# EAGLE design BigGridPixel (EAGLE 5.10)
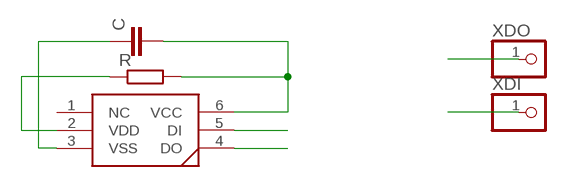
[diagram p0: schematic, sheet 1]

## Parts
C  C-EUC0805  [C0805]
R  R-EU_R0805  [R0805]
U$1  WS2812  [5050LED]
XDI  PINHD-1X1  [1X01]
XDO  PINHD-1X1  [1X01]

## Nets
DI: U$1.5(DI)
DO: U$1.4(DO)
N$1: C.2 R.2 U$1.6(VCC)
VDD: R.1 U$1.2(VDD)
VSS: C.1 U$1.3(VSS)
XDI: XDI.1
XDO: XDO.1
Unconnected: U$1.1(NC)

## Library data of the parts
C = rcl:C-EU: CAPACITOR, European symbol
R = rcl:R-EU_: RESISTOR, European symbol
U$1 = jasons_stuff:WS2812
XDI XDO = adafruit:PINHD-1X1: Pin header 1x1 for 0.1" spacing With round pins

## Board
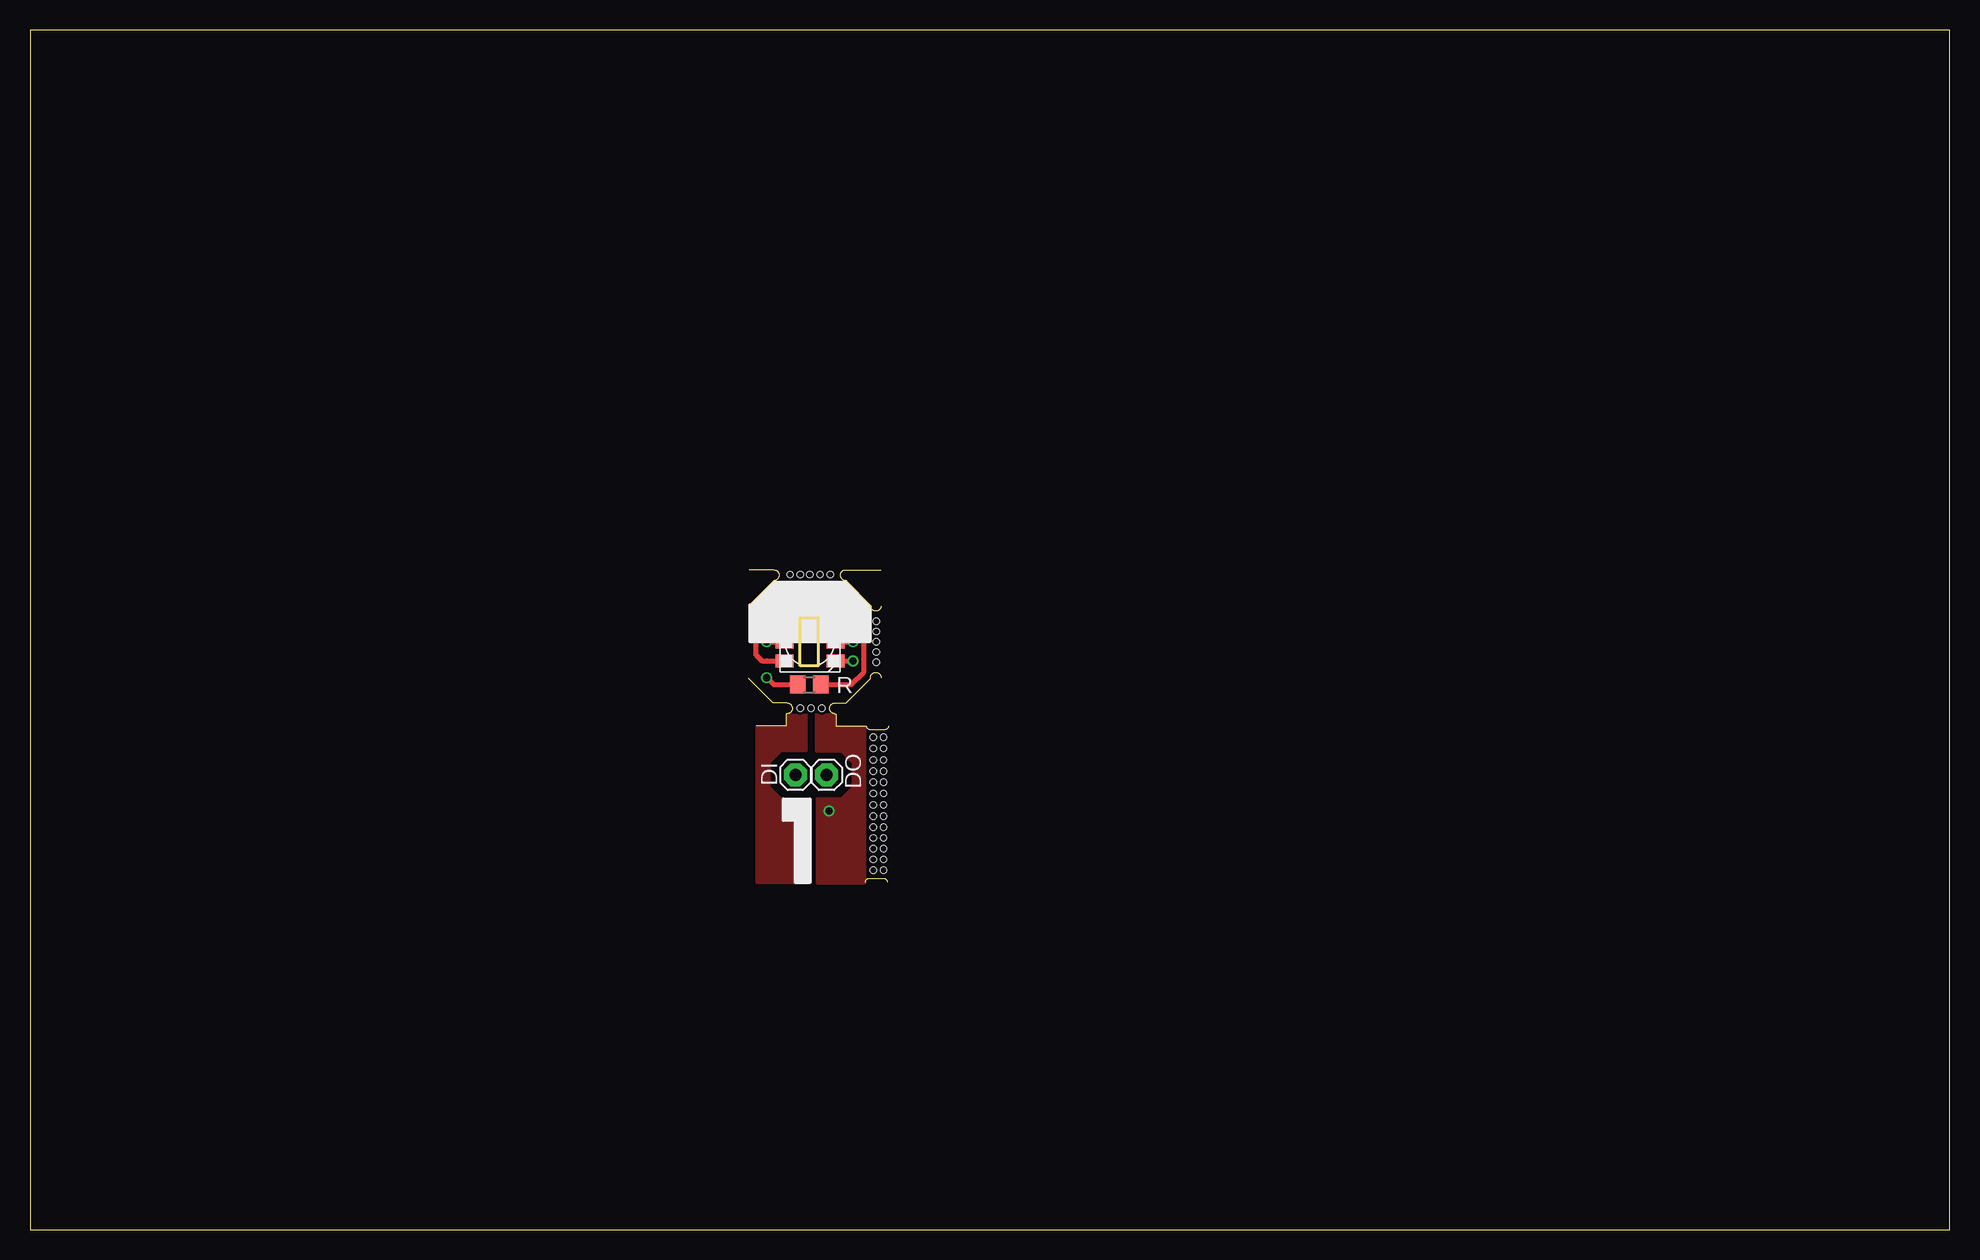
[diagram p1: board, top side]
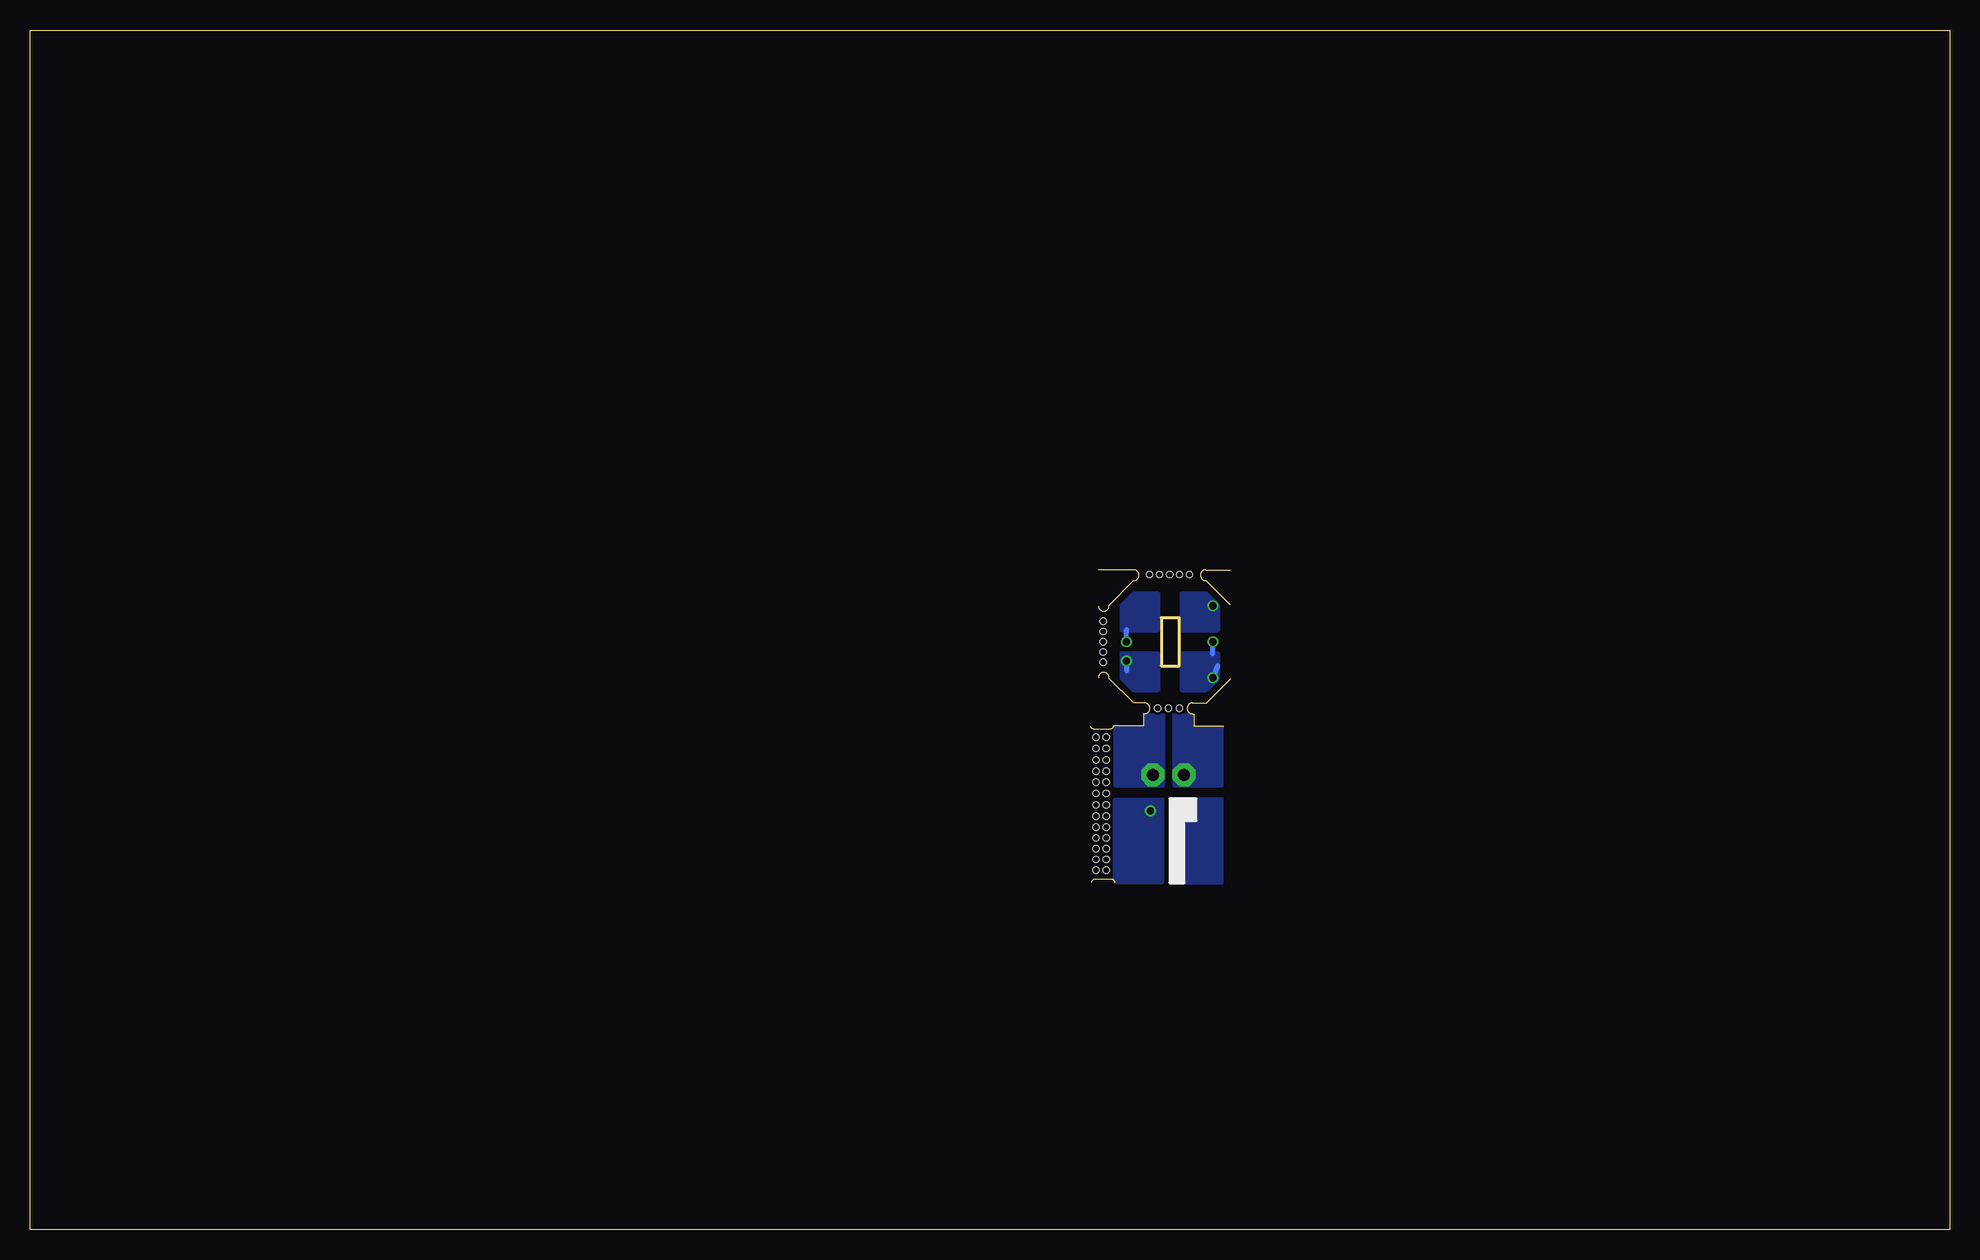
[diagram p2: board, bottom side, seen from below]

Size 160 x 100 mm. Coordinates in mm from the lower left corner, seen from the top.
Outline: 0,0 160,0 160,100 0,100 0,0
Copper layers (1*16): Top 0.035mm / dielectric 1.5mm / Bottom 0.035mm
Design rules "dirt_cheap_dirty_boards.v1": minimum track width 5mil, minimum drill 12mil, track to track 5mil, track to pad 5mil, pad to pad 5mil, via to via 5mil, smd to smd 0mil, copper to edge 10mil, drill to drill 10mil, minimum pad ring 10mil, minimum via ring 6mil, stop-mask expansion 2mil, vias tented up to drill 25mil, thermal gap 10mil
Holes 0.5 mm at 64.2,43.45 66,43.45 65.1,43.45 63.35,54.6 65.85,54.6 64.2,54.6 65,54.6 66.7,54.6 70.55,49 70.55,50.7 70.55,49.85 70.55,48.15 70.55,47.3 70.3,41.05 70.3,40.1 70.3,39.15 70.3,38.2 70.3,37.3 70.3,36.35 70.3,35.4 70.3,34.45 70.3,33.55 70.3,32.65 70.3,31.75 70.3,30.85 70.3,29.95 71.15,41.05 71.15,40.1 71.15,39.15 71.15,38.2 71.15,37.3 71.15,36.35 71.15,35.4 71.15,34.45 71.15,33.55 71.15,32.65 71.15,31.75 71.15,30.85 71.15,29.95
Milling: 33 lines

### Footprints (pad centres in the part's own frame; a part is rotated, then mirrored left to right if it is on the bottom)
C0805 = smd 1.3 x 1.5: 1 -0.95,0; 2 0.95,0
R0805 = smd 1.3 x 1.5: 1 -0.95,0; 2 0.95,0
5050LED = smd 1.5 x 1.1: 1 -2.16,1.59; 2 -2.11,-0.01; 3 -2.11,-1.61; 4 2.14,-1.61; 5 2.14,-0.01; 6 2.14,1.59
1X01 = drill 1.016 pad 1.93 octagon: 1 0,0

### Placement (x,y rotation side)
C  64.96,52.6 0 top
R  64.96,45.42 0 top
U$1  65,49 0 top
XDI  63.8,37.9 0 top
XDO  66.4,37.9 0 top

### Tracks (layer width: path | path; a pad name or v marks a point on that pad's centre or on a via)
DI  (via drill 0.6 pad 0.25)
  Top 0.406: v68.6,49 U$1.5
  Bottom 0.406: v68.6,49 68.6,50
  pour Bottom: 66,50 66,53 68,53 69,52 69,50
DO  (via drill 0.6 pad 0.25)
  Top 0.406: U$1.4 v68.59,47.39 v68.6,47.4
  Bottom 0.406: v68.6,47.4 68.6,46.6
  pour Bottom: 66,48 69,48 69,46 68,45 66,45
N$1
  Top 0.406: C.2 66.9,52.6 67.14,52.36 U$1.6 69.21,50.59 69.5,50.6 69.5,46.5 68.42,45.42 R.2
VDD  (via drill 0.6 pad 0.25)
  Top 0.406: 63.59,45 R.1 61.98,45.42 v61.4,46 | U$1.2 v61.4,49
  Bottom 0.406: 61.4,48 v61.4,49 | v61.4,46 61,47
  pour Bottom: 64,45 62,45 61,46 61,48 64,48
VSS  (via drill 0.6 pad 0.25)
  Top 0.406: U$1.3 61.51,47.39 61.4,47.4 61,47.4 60.5,47.9 60.5,51.1 v61.4,52 62,52.6 C.1
  pour Bottom: 64,50 61,50 61,52 62,53 64,53
XDI
  pour Bottom (no thermals): 60.6,41.9 63.1,41.9 63.1,42.9 64.7,42.9 64.7,37 60.6,37
XDO
  pour Bottom (no thermals): 65.5,37 65.5,42.9 67.1,42.9 67.1,41.9 69.6,41.9 69.6,37
XVDD  (via drill 0.6 pad 0.25)
  other vias: 66.6,34.9
  pour Bottom: 65.6,35.9 65.6,28.9 69.6,28.9 69.6,35.9
  pour Top: 65.5,42.9 65.5,39.9 67.6,39.9 68.6,38.9 68.6,36.9 67.6,35.9 65.6,35.9 65.6,28.9 69.6,28.9 69.6,41.9 67.1,41.9 67.1,42.9
XVSS  (via drill 0.6 pad 0.25)
  other vias: 63.6,34.9
  pour Bottom: 60.6,35.9 64.6,35.9 64.6,28.9 60.6,28.9
  pour Top: 63.1,42.9 64.7,42.9 64.7,39.9 62.6,39.9 61.6,38.9 61.6,36.9 62.6,35.9 64.6,35.9 64.6,28.9 60.6,28.9 60.6,41.9 63.1,41.9

### Text on the board
tPlace: C | C | R | DI | DO